# Altium schematic sheet SC16IS740.SchDoc
size B
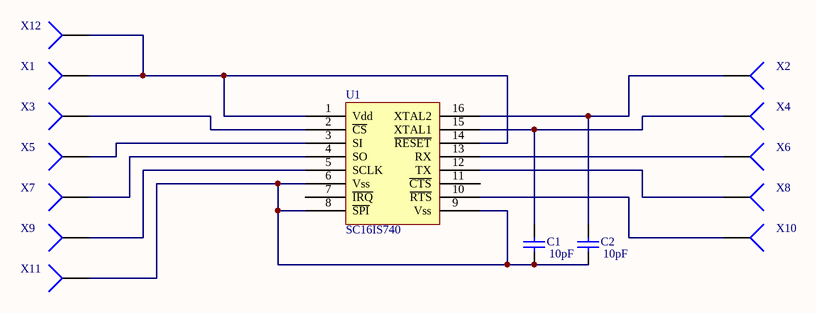
[diagram p0: SC16IS740.SchDoc]

## Parts
C1  10pF  [_1206]
C2  10pF  [_1206]
U1  SC16IS740  [TSSO5X6-G16]
X1  (no value)  [PIN1]
X2  (no value)  [PIN1]
X3  (no value)  [PIN1]
X4  (no value)  [PIN1]
X5  (no value)  [PIN1]
X6  (no value)  [PIN1]
X7  (no value)  [PIN1]
X8  (no value)  [PIN1]
X9  (no value)  [PIN1]
X10  (no value)  [PIN1]
X11  (no value)  [PIN1]
X12  (no value)  [PIN1]

## Nets
NetC1_1: C1.1 C2.1 U1.6(Vss) U1.8(~{SPI}) U1.9(Vss) X11.1
NetC1_2: C1.2 U1.15(XTAL1) X4.1
NetC2_2: C2.2 U1.16(XTAL2) X2.1
NetU1_1: U1.1(Vdd) U1.14(~{RESET}) X1.1 X12.1
NetU1_2: U1.2(~{CS}) X3.1
NetU1_3: U1.3(SI) X5.1
NetU1_4: U1.4(SO) X7.1
NetU1_5: U1.5(SCLK) X9.1
NetU1_10: U1.10(~{RTS}) X10.1
NetU1_12: U1.12(TX) X8.1
NetU1_13: U1.13(RX) X6.1

Not connected (* = marked no-connect by the designer): U1 7(~{IRQ}) 11(~{CTS})

## Library data of the parts
C1 C2 = Cap Semi: Capacitor; Manufacturer: Generic Components; Class I: Passive; Value: 0,1; Published: 8-Jun-2000; Revision: July-2002: Re-released for DXP Platform.; Publisher: Altium Limited; Class II: Capacitor
X1-X12 = Socket: Manufacturer: Generic Components; Class I: Connector; Revision: July-2002: Re-released for DXP Platform.; Publisher: Altium Limited